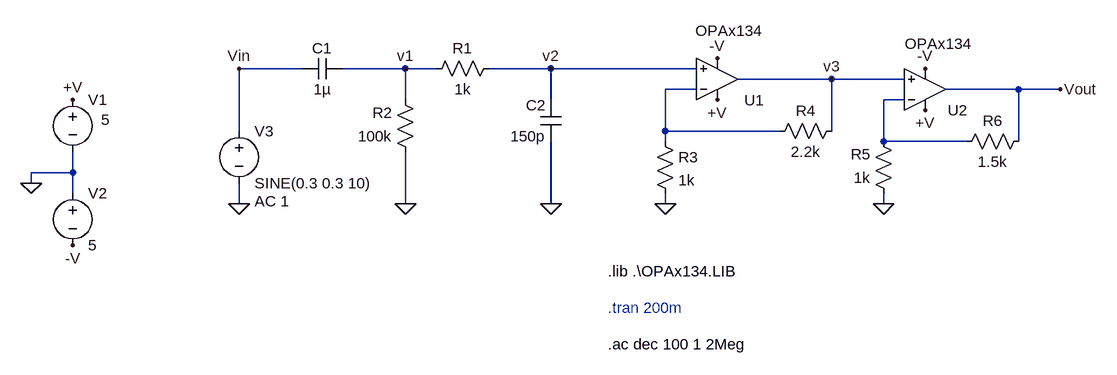
[diagram p0: schematic Filtro y amplificador.asc]
Filtro y amplificador.asc, the LTspice schematic file:
Version 4.1
SHEET 1 968 680
WIRE -272 64 -368 64
WIRE -112 64 -208 64
WIRE -64 64 -112 64
WIRE 112 64 16 64
WIRE 336 64 112 64
WIRE 544 80 400 80
WIRE 656 80 544 80
WIRE 336 96 288 96
WIRE 832 96 720 96
WIRE 896 96 832 96
WIRE -112 112 -112 64
WIRE 112 112 112 64
WIRE 656 112 624 112
WIRE -368 160 -368 64
WIRE 288 160 288 96
WIRE 464 160 288 160
WIRE 544 160 544 80
WIRE 288 176 288 160
WIRE 624 176 624 112
WIRE 752 176 624 176
WIRE 832 176 832 96
WIRE -624 224 -624 192
WIRE -624 224 -688 224
WIRE -688 240 -688 224
WIRE -624 256 -624 224
WIRE -368 272 -368 240
WIRE -112 272 -112 192
WIRE 112 272 112 176
WIRE 288 272 288 256
WIRE 624 272 624 256
FLAG 688 128 +V
FLAG 368 112 +V
FLAG 688 64 -V
FLAG 368 48 -V
FLAG 896 96 Vout
FLAG -688 240 0
FLAG -624 112 +V
FLAG -624 336 -V
FLAG -368 272 0
FLAG -112 272 0
FLAG 112 272 0
FLAG 288 272 0
FLAG 624 272 0
FLAG -368 64 Vin
FLAG -112 64 v1
FLAG 112 64 v2
FLAG 544 80 v3
SYMBOL OpAmps\\opamp2 368 144 M180
WINDOW 0 42 31 Left 2
WINDOW 3 -34 138 Left 2
SYMATTR InstName U1
SYMATTR Value OPAx134
SYMBOL OpAmps\\opamp2 688 160 M180
WINDOW 0 35 32 Left 2
WINDOW 3 -31 134 Left 2
SYMATTR InstName U2
SYMATTR Value OPAx134
SYMBOL voltage -624 96 R0
WINDOW 3 44 47 Left 2
WINDOW 123 0 0 Left 0
WINDOW 39 0 0 Left 0
SYMATTR Value 5
SYMATTR InstName V1
SYMBOL voltage -624 240 R0
WINDOW 123 0 0 Left 0
WINDOW 39 0 0 Left 0
SYMATTR InstName V2
SYMATTR Value 5
SYMBOL voltage -368 144 R0
WINDOW 123 24 124 Left 2
WINDOW 39 0 0 Left 0
SYMATTR Value2 AC 1
SYMATTR InstName V3
SYMATTR Value SINE(0.3 0.3 10)
SYMBOL cap -208 48 R90
WINDOW 0 0 32 VBottom 2
WINDOW 3 32 32 VTop 2
SYMATTR InstName C1
SYMATTR Value 1µ
SYMBOL cap 128 176 R180
WINDOW 0 24 56 Left 2
WINDOW 3 24 8 Left 2
SYMATTR InstName C2
SYMATTR Value 150p
SYMBOL res 32 48 R90
WINDOW 0 0 56 VBottom 2
WINDOW 3 32 56 VTop 2
SYMATTR InstName R1
SYMATTR Value 1k
SYMBOL res -96 208 R180
WINDOW 0 36 76 Left 2
WINDOW 3 36 40 Left 2
SYMATTR InstName R2
SYMATTR Value 100k
SYMBOL res 272 160 R0
SYMATTR InstName R3
SYMATTR Value 1k
SYMBOL res 560 144 R90
WINDOW 0 0 56 VBottom 2
WINDOW 3 32 56 VTop 2
SYMATTR InstName R4
SYMATTR Value 2.2k
SYMBOL res 640 272 R180
WINDOW 0 36 76 Left 2
WINDOW 3 36 40 Left 2
SYMATTR InstName R5
SYMATTR Value 1k
SYMBOL res 736 192 R270
WINDOW 0 32 56 VTop 2
WINDOW 3 0 56 VBottom 2
SYMATTR InstName R6
SYMATTR Value 1.5k
TEXT 200 376 Left 2 !.lib .\\OPAx134.LIB
TEXT 200 432 Left 2 ;.tran 200m
TEXT 200 488 Left 2 !.ac dec 100 1 2Meg

The netlist it stands for:
* Filtro y amplificador.asc
X§U1 v2 N001 +V -V v3 OPAx134  ; pins In+ In- V+ V- OUT
X§U2 v3 N002 +V -V Vout OPAx134  ; pins In+ In- V+ V- OUT
V1 +V 0 5
V2 0 -V 5
V3 Vin 0 SINE(0.3 0.3 10) AC 1
C1 v1 Vin 1µ
C2 0 v2 150p
R1 v2 v1 1k
R2 0 v1 100k
R3 N001 0 1k
R4 v3 N001 2.2k
R5 0 N002 1k
R6 N002 Vout 1.5k
.lib .\OPAx134.LIB
* .tran 200m
.ac dec 100 1 2Meg
.backanno
.end